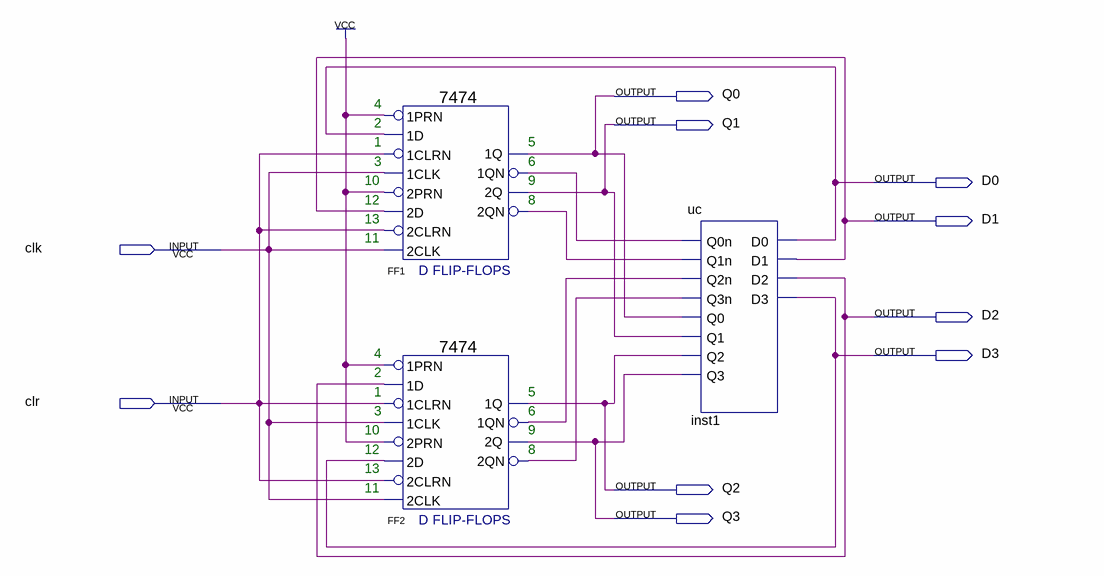
[diagram p0: schematic sheet]
// Quartus schematic exp04.bdf as structural Verilog: 3 symbols, 10 pins
module exp04 (
  input  clk,
  input  clr,
  output Q0,
  output Q1,
  output D0,
  output D1,
  output D2,
  output D3,
  output Q2,
  output Q3
);

  wire FF1_1qn, FF1_2qn, FF2_1qn, FF2_2qn;

  \7474  FF1 (
    .\2D (D1), .\2PRN (1'b1), .\1CLK (clk), .\1D (D0), .\1PRN (1'b1), .\2CLK (clk), .\2CLRN (clr),
    .\1CLRN (clr), .\1QN (FF1_1qn), .\2Q (Q1), .\2QN (FF1_2qn), .\1Q (Q0));
  \7474  FF2 (
    .\2D (D3), .\2PRN (1'b1), .\1CLK (clk), .\1D (D2), .\1PRN (1'b1), .\2CLK (clk), .\2CLRN (clr),
    .\1CLRN (clr), .\1QN (FF2_1qn), .\2Q (Q3), .\2QN (FF2_2qn), .\1Q (Q2));
  uc inst1 (
    .Q0n(FF1_1qn), .Q1n(FF1_2qn), .Q2n(FF2_1qn), .Q3n(FF2_2qn), .Q0(Q0), .Q1(Q1), .Q2(Q2), .Q3(Q3), .D0(D0),
    .D1(D1), .D2(D2), .D3(D3));

  // Notes on the sheet:
  //   4
  //   2
  //   1
  //   5
  //   3
  //   6
  //   10
  //   9
  //   12
  //   8
  //   13
  //   11
  //   4
  //   2
  //   1
  //   5
  //   3
  //   6
  //   10
  //   9
  //   12
  //   8
  //   13
  //   11
endmodule
